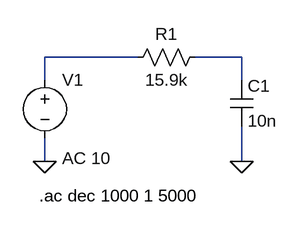
[diagram p0: schematic low_pass_bilinear.asc]
low_pass_bilinear.asc, the LTspice schematic file:
Version 4.1
SHEET 1 880 680
WIRE 160 80 32 80
WIRE 304 80 240 80
WIRE 32 112 32 80
WIRE 304 112 304 80
WIRE 32 224 32 192
WIRE 304 224 304 176
FLAG 32 224 0
FLAG 304 224 0
SYMBOL cap 288 112 R0
SYMATTR InstName C1
SYMATTR Value 10n
SYMBOL res 256 64 R90
WINDOW 0 0 56 VBottom 2
WINDOW 3 32 56 VTop 2
SYMATTR InstName R1
SYMATTR Value 15.9k
SYMBOL voltage 32 96 R0
WINDOW 123 24 124 Left 2
WINDOW 39 0 0 Left 0
SYMATTR InstName V1
SYMATTR Value ""
SYMATTR Value2 AC 10
TEXT 24 272 Left 2 !.ac dec 1000 1 5000

The netlist it stands for:
* low_pass_bilinear.asc
C1 N002 0 10n
R1 N002 N001 15.9k
V1 N001 0 AC 10
.ac dec 1000 1 5000
.backanno
.end